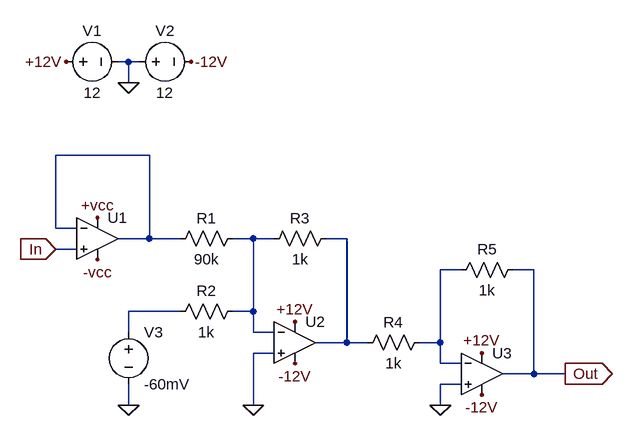
[diagram p0: schematic Modulo-Procesamiento.asc]
Modulo-Procesamiento.asc, the LTspice schematic file:
Version 4
SHEET 1 2272 680
WIRE 1232 -256 1216 -256
WIRE 1248 -256 1232 -256
WIRE 1232 -224 1232 -256
WIRE 1264 -112 1120 -112
WIRE 1120 0 1120 -112
WIRE 1152 0 1120 0
WIRE 1264 16 1264 -112
WIRE 1264 16 1216 16
WIRE 1312 16 1264 16
WIRE 1424 16 1392 16
WIRE 1456 16 1424 16
WIRE 1568 16 1536 16
WIRE 1152 32 1120 32
WIRE 1744 64 1712 64
WIRE 1856 64 1824 64
WIRE 1312 128 1232 128
WIRE 1424 128 1424 16
WIRE 1424 128 1392 128
WIRE 1232 160 1232 128
WIRE 1424 160 1424 128
WIRE 1456 160 1424 160
WIRE 1568 176 1568 16
WIRE 1568 176 1520 176
WIRE 1600 176 1568 176
WIRE 1712 176 1712 64
WIRE 1712 176 1680 176
WIRE 1456 192 1424 192
WIRE 1712 208 1712 176
WIRE 1744 208 1712 208
WIRE 1856 224 1856 64
WIRE 1856 224 1808 224
WIRE 1904 224 1856 224
WIRE 1744 240 1712 240
WIRE 1232 272 1232 240
WIRE 1424 272 1424 192
WIRE 1712 272 1712 240
FLAG 1232 -224 0
FLAG 1136 -256 +12V
FLAG 1328 -256 -12V
FLAG 1184 -16 +vcc
FLAG 1184 48 -vcc
FLAG 1424 272 0
FLAG 1232 272 0
FLAG 1712 272 0
FLAG 1904 224 Out
IOPIN 1904 224 Out
FLAG 1120 32 In
IOPIN 1120 32 In
FLAG 1488 144 +12V
FLAG 1776 192 +12V
FLAG 1488 208 -12V
FLAG 1776 256 -12V
SYMBOL OpAmps\\UniversalOpAmp 1184 16 R0
SYMATTR InstName U1
SYMBOL OpAmps\\UniversalOpAmp 1488 176 R0
SYMATTR InstName U2
SYMBOL OpAmps\\UniversalOpAmp 1776 224 R0
SYMATTR InstName U3
SYMBOL res 1408 0 R90
WINDOW 0 0 56 VBottom 2
WINDOW 3 32 56 VTop 2
SYMATTR InstName R1
SYMATTR Value 90k
SYMBOL res 1408 112 R90
WINDOW 0 0 56 VBottom 2
WINDOW 3 32 56 VTop 2
SYMATTR InstName R2
SYMATTR Value 1k
SYMBOL res 1696 160 R90
WINDOW 0 0 56 VBottom 2
WINDOW 3 32 56 VTop 2
SYMATTR InstName R4
SYMATTR Value 1k
SYMBOL res 1552 0 R90
WINDOW 0 0 56 VBottom 2
WINDOW 3 32 56 VTop 2
SYMATTR InstName R3
SYMATTR Value 1k
SYMBOL voltage 1120 -256 R270
WINDOW 0 32 56 VTop 2
WINDOW 3 -32 56 VBottom 2
WINDOW 123 0 0 Left 0
WINDOW 39 0 0 Left 0
SYMATTR InstName V1
SYMATTR Value 12
SYMBOL voltage 1232 -256 R270
WINDOW 0 32 56 VTop 2
WINDOW 3 -32 56 VBottom 2
WINDOW 123 0 0 Left 0
WINDOW 39 0 0 Left 0
SYMATTR InstName V2
SYMATTR Value 12
SYMBOL res 1840 48 R90
WINDOW 0 0 56 VBottom 2
WINDOW 3 32 56 VTop 2
SYMATTR InstName R5
SYMATTR Value 1k
SYMBOL voltage 1232 144 R0
WINDOW 123 0 0 Left 0
WINDOW 39 0 0 Left 0
SYMATTR InstName V3
SYMATTR Value -60mV

The netlist it stands for:
* Modulo-Procesamiento.asc
XU1 In N001 +vcc -vcc N001 level1 Avol=1Meg GBW=10Meg Vos=0 En=0 Enk=0 In=0 Ink=0 Rin=500Meg  ; pins In+ In- V+ V- OUT
XU2 0 N002 +12V -12V N003 level1 Avol=1Meg GBW=10Meg Vos=0 En=0 Enk=0 In=0 Ink=0 Rin=500Meg  ; pins In+ In- V+ V- OUT
XU3 0 N004 +12V -12V Out level1 Avol=1Meg GBW=10Meg Vos=0 En=0 Enk=0 In=0 Ink=0 Rin=500Meg  ; pins In+ In- V+ V- OUT
R1 N002 N001 90k
R2 N002 N005 1k
R4 N004 N003 1k
R3 N003 N002 1k
V1 +12V 0 12
V2 0 -12V 12
R5 Out N004 1k
V3 N005 0 -60mV
.lib UniversalOpAmp1.lib
.backanno
.end